# EAGLE design remoteVolume (EAGLE 6.5.0)
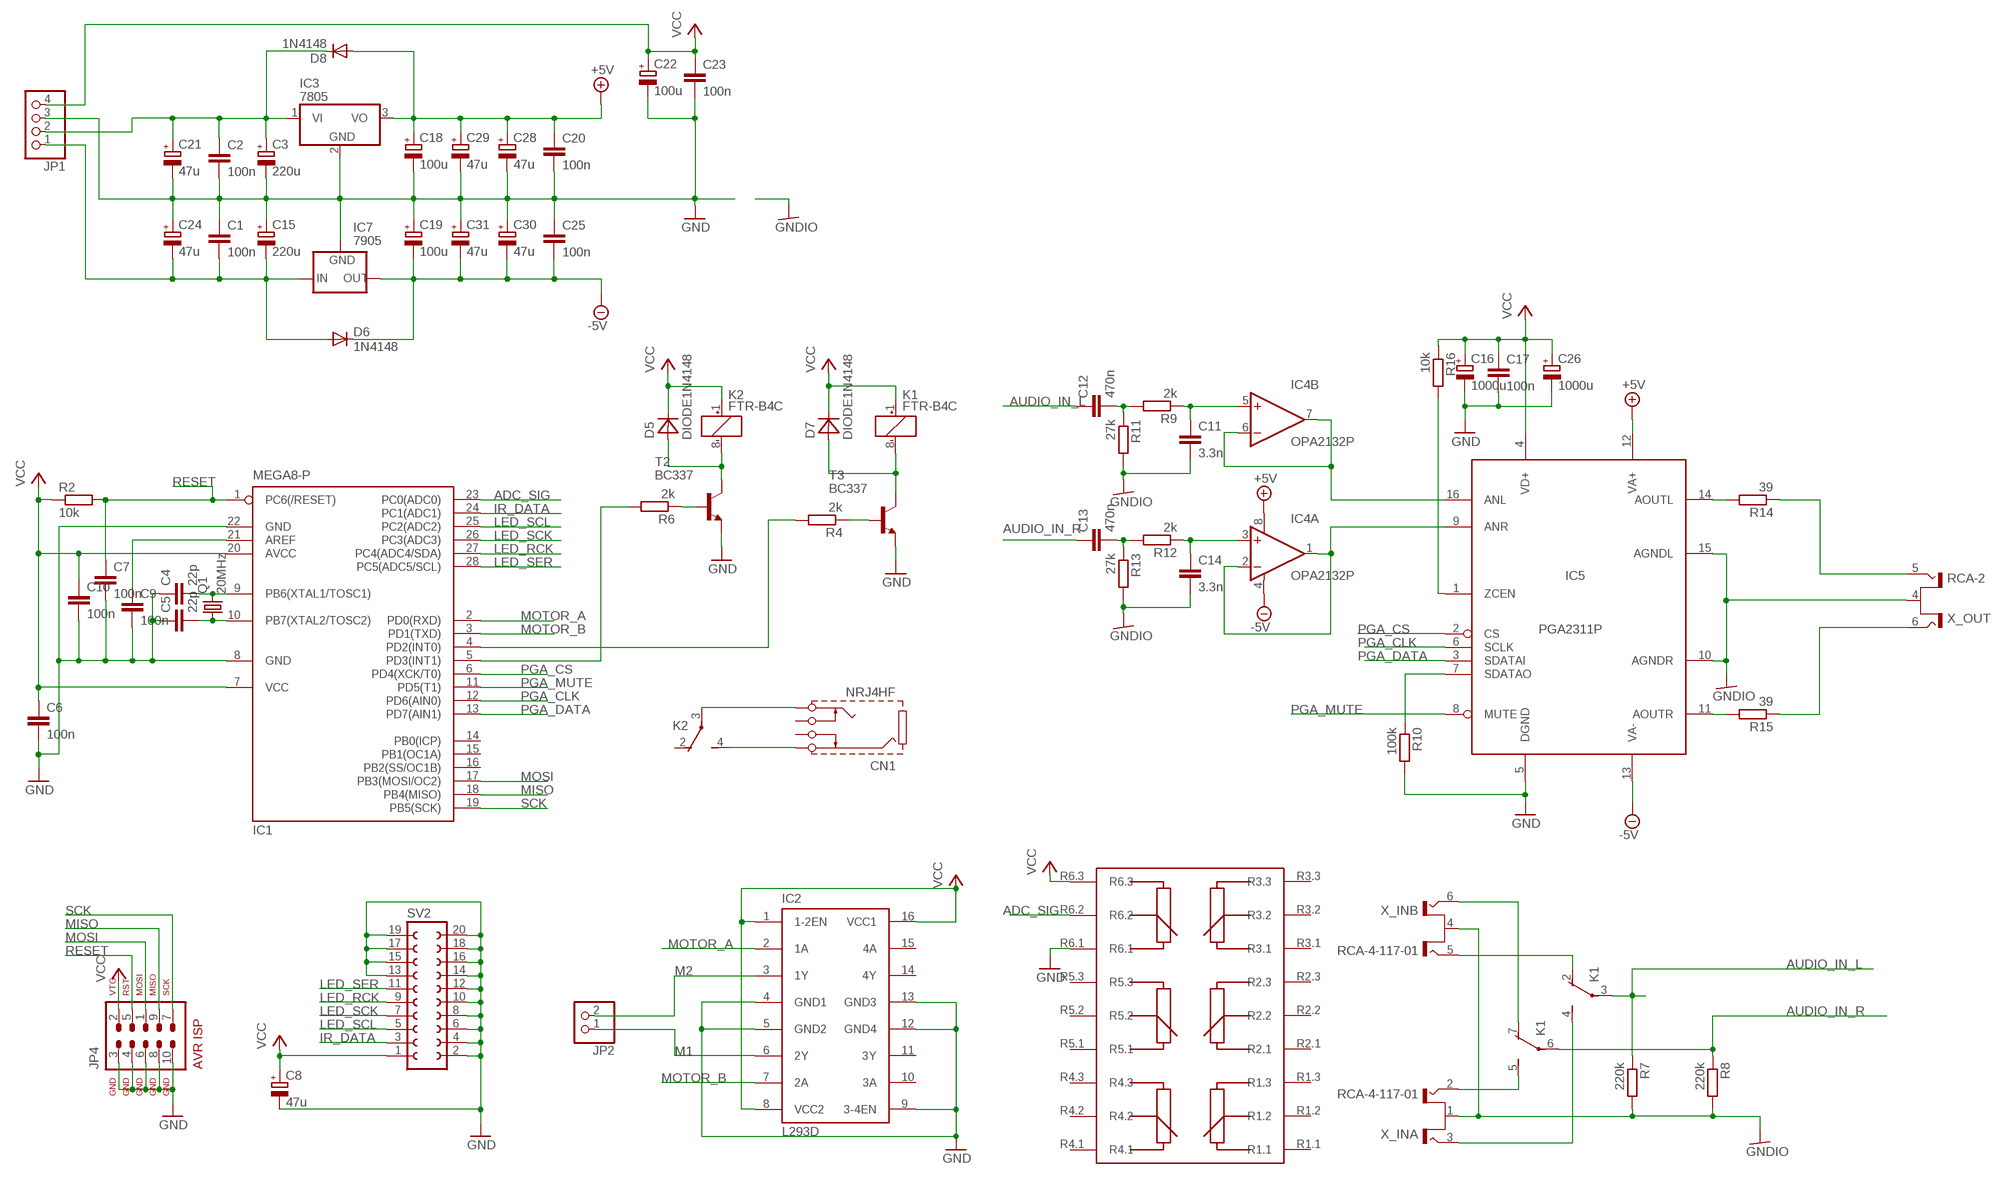
[diagram p0: schematic, sheet 1]

## Parts
C1  100n  C-EU025-025X050  [C025-025X050]
C2  100n  C-EU025-025X050  [C025-025X050]
C3  220u  CPOL-EUE2.5-6  [E2,5-6]
C4  22p  C-EU025-025X050  [C025-025X050]
C5  22p  C-EU025-025X050  [C025-025X050]
C6  100n  C-EU025-025X050  [C025-025X050]
C7  100n  C-EU025-025X050  [C025-025X050]
C8  47u  CPOL-EUE2.5-6  [E2,5-6]
C9  100n  C-EU025-025X050  [C025-025X050]
C10  100n  C-EU025-025X050  [C025-025X050]
C11  3.3n  C-EU050-055X075  [C050-055X075]
C12  470n  C5/3.5  [C5B3.5]
C13  470n  C5/3.5  [C5B3.5]
C14  3.3n  C-EU050-055X075  [C050-055X075]
C15  220u  CPOL-EUE2.5-6  [E2,5-6]
C16  1000u  CPOL-EUE3.5-8  [E3,5-8]
C17  100n  C-EU025-025X050  [C025-025X050]
C18  100u  CPOL-EUE2.5-5  [E2,5-5]
C19  100u  CPOL-EUE2.5-5  [E2,5-5]
C20  100n  C-EU025-025X050  [C025-025X050]
C21  47u  CPOL-EUE2.5-5  [E2,5-5]
C22  100u  CPOL-EUE2.5-5  [E2,5-5]
C23  100n  C-EU025-025X050  [C025-025X050]
C24  47u  CPOL-EUE2.5-5  [E2,5-5]
C25  100n  C-EU025-025X050  [C025-025X050]
C26  1000u  CPOL-EUE3.5-8  [E3,5-8]
C28  47u  CPOL-EUE2.5-5  [E2,5-5]
C29  47u  CPOL-EUE2.5-5  [E2,5-5]
C30  47u  CPOL-EUE2.5-5  [E2,5-5]
C31  47u  CPOL-EUE2.5-5  [E2,5-5]
CN1  NRJ4HF  [NRJ4HF]
D5  DIODE1N4148  [DO-35]
D6  1N4148  1N4148DO35-7  [DO35-7]
D7  DIODE1N4148  [DO-35]
D8  1N4148  1N4148DO35-7  [DO35-7]
IC1  MEGA8-P  [DIL28-3]
IC2  L293D  [DIL16]
IC3  7805  7805TV  [TO220V]
IC4  OPA2132P  [DIL08]
IC5  PGA2311P  [DIL16]
IC7  7905  79XXS  [79XXS]
JP1  PINHD-1X4/90  [1X04/90]
JP2  PINHD-1X2  [1X02]
JP4  AVR-ISP-10  [AVR-ISP-10]
K1  FTR-B4C  [FTR-B4C]
K2  FTR-B4C  [FTR-B4C]
Q1  20MHz  CRYSTALHC49S  [HC49/S]
R2  10k  R-EU_0207/7  [0207/7]
R4  2k  R-EU_0207/7  [0207/7]
R6  2k  R-EU_0207/7  [0207/7]
R7  220k  R-EU_0207/7  [0207/7]
R8  220k  R-EU_0207/7  [0207/7]
R9  2k  R-EU_0207/7  [0207/7]
R10  100k  R-EU_0207/7  [0207/7]
R11  27k  R-EU_0207/7  [0207/7]
R12  2k  R-EU_0207/7  [0207/7]
R13  27k  R-EU_0207/7  [0207/7]
R14  39  R-EU_0207/7  [0207/7]
R15  39  R-EU_0207/7  [0207/7]
R16  10k  R-EU_0207/7  [0207/7]
SV2  FE10-2W  [FE10-2W]
T2  BC337  [TO92]
T3  BC337  [TO92]
U$1  RK16816MG  [RK16816MG]
X_IN  RCA-4-117-01  [RCA-4-117-01]
X_OUT  RCA-2  [RCA-2]

## Nets
+5V: C18.+ C20.1 C28.+ C29.+ D8.A IC3.3(VO) IC4.8(A:V+) IC5.12(VA+)
-5V: C19.- C25.2 C30.- C31.- D6.C IC4.4(A:V-) IC5.13(VA-) IC7.OUT
ADC_SIG: IC1.23(PC0(ADC0)) U$1.R6.2
AUDIO_IN_L: C12.1 K1.3(-1:P) R7.1
AUDIO_IN_R: C13.1 K1.6(-2:P) R8.1
GND: C1.1 C2.2 C3.- C4.1 C5.1 C6.2 C7.2 C8.- C9.2 C10.2 C15.+ C16.- C17.2 C18.- C19.+ C20.2 C21.- C22.- C23.2 C24.+ C25.1 C26.- C28.- C29.- C30.+ C31.+ IC1.8(GND) IC1.22(GND) IC2.4(GND1) IC2.5(GND2) IC2.9(3-4EN) IC2.12(GND4) IC2.13(GND3) IC3.2(GND) IC5.5(DGND) IC7.GND JP1.3 JP4.3 JP4.4 JP4.6 JP4.8 JP4.10 R10.2 SV2.2 SV2.4 SV2.6 SV2.8 SV2.10 SV2.12 SV2.13 SV2.14 SV2.15 SV2.16 SV2.17 SV2.18 SV2.19 SV2.20 T2.1(E) T3.1(E) U$1.R6.1
GNDIO: C11.2 C14.2 IC5.10(AGNDR) IC5.15(AGNDL) R7.2 R8.2 R11.2 R13.2 X_IN.1(A:S) X_IN.4(B:S) X_OUT.4(S)
IR_DATA: IC1.24(PC1(ADC1)) SV2.3
LED_RCK: IC1.27(PC4(ADC4/SDA)) SV2.9
LED_SCK: IC1.26(PC3(ADC3)) SV2.7
LED_SCL: IC1.25(PC2(ADC2)) SV2.5
LED_SER: IC1.28(PC5(ADC5/SCL)) SV2.11
M1: IC2.6(2Y) JP2.1
M2: IC2.3(1Y) JP2.2
MISO: IC1.18(PB4(MISO)) JP4.9
MOSI: IC1.17(PB3(MOSI/OC2)) JP4.1
MOTOR_A: IC1.2(PD0(RXD)) IC2.2(1A)
MOTOR_B: IC1.3(PD1(TXD)) IC2.7(2A)
N$1: CN1.SLEEVE K2.4(-1:S)
N$2: IC4.1(A:OUT) IC4.2(A:-IN) IC5.9(ANR)
N$3: C2.1 C3.+ C21.+ D8.C IC3.1(VI) JP1.2
N$4: C1.2 C15.- C24.- D6.A IC7.IN JP1.1
N$5: K1.5(-2:S) X_IN.2(A:T1)
N$6: D7.+ K1.8(K:-) T3.3(C)
N$7: C4.2 IC1.9(PB6(XTAL1/TOSC1)) Q1.2
N$8: C5.2 IC1.10(PB7(XTAL2/TOSC2)) Q1.1
N$9: R4.1 T3.2(B)
N$10: IC1.4(PD2(INT0)) R4.2
N$11: K1.7(-2:O) X_IN.6(B:T2)
N$12: IC1.5(PD3(INT1)) R6.2
N$14: K1.2(-1:O) X_IN.5(B:T1)
N$15: R6.1 T2.2(B)
N$17: K1.4(-1:S) X_IN.3(A:T2)
N$18: D5.+ K2.8(K:-) T2.3(C)
N$20: CN1.TIP K2.3(-1:P)
N$22: C9.1 IC1.21(AREF)
N$23: IC4.6(B:-IN) IC4.7(B:OUT) IC5.16(ANL)
N$25: C12.2 R9.2 R11.1
N$27: C11.1 IC4.5(B:+IN) R9.1
N$29: C14.1 IC4.3(A:+IN) R12.1
N$31: R14.1 X_OUT.5(T1)
N$32: R15.1 X_OUT.6(T2)
N$33: C13.2 R12.2 R13.1
N$35: IC5.7(SDATAO) R10.1
N$36: IC5.14(AOUTL) R14.2
N$37: IC5.11(AOUTR) R15.2
N$38: IC5.1(ZCEN) R16.2
PGA_CLK: IC1.12(PD6(AIN0)) IC5.6(SCLK)
PGA_CS: IC1.6(PD4(XCK/T0)) IC5.2(CS)
PGA_DATA: IC1.13(PD7(AIN1)) IC5.3(SDATAI)
PGA_MUTE: IC1.11(PD5(T1)) IC5.8(MUTE)
RESET: C7.1 IC1.1(PC6(/RESET)) JP4.5 R2.2
SCK: IC1.19(PB5(SCK)) JP4.7
VCC: C6.1 C8.+ C10.1 C16.+ C17.1 C22.+ C23.1 C26.+ D5.- D7.- IC1.7(VCC) IC1.20(AVCC) IC2.1(1-2EN) IC2.8(VCC2) IC2.16(VCC1) IC5.4(VD+) JP1.4 JP4.2 K1.1(K:+) K2.1(K:+) R2.1 R16.1 SV2.1 U$1.R6.3
Unconnected: CN1.SLEEVE-S CN1.TIP-S IC1.14(PB0(ICP)) IC1.15(PB1(OC1A)) IC1.16(PB2(SS/OC1B)) IC2.10(3A) IC2.11(3Y) IC2.14(4Y) IC2.15(4A) K2.2(-1:O) K2.5(-2:S) K2.6(-2:P) K2.7(-2:O) U$1.R1.1 U$1.R1.2 U$1.R1.3 U$1.R2.1 U$1.R2.2 U$1.R2.3 U$1.R3.1 U$1.R3.2 U$1.R3.3 U$1.R4.1 U$1.R4.2 U$1.R4.3 U$1.R5.1 U$1.R5.2 U$1.R5.3

## Library data of the parts
C1 C2 C4-C7 C9-C11 C14 C17 C20 C23 C25 = rcl:C-EU: CAPACITOR, European symbol
C3 C8 C15 C16 C18 C19 C21 C22 C24 C26 C28-C31 = rcl:CPOL-EU: POLARIZED CAPACITOR, European symbol
C12 C13 = capacitor-wima:C: CAPACITOR naming: grid - package width
CN1 = audio:NRJ4HF: Neutrik 1/4" Mono Phone Connector
D5 D7 = Diodes:DIODE: Diode; SPICE: D{NAME} {+.NET} {-.NET} 1N4148; SPICEMOD: .model 1N4148 D (IS=0.1PA, RS=16 CJO=2PF TT=12N BV=100 IBV=1nA)
D6 D8 = diode:1N4148: DIODE high speed (Philips)
IC1 = atmel:MEGA8-P: MICROCONTROLLER 8 Kbytes FLASH, 1 kbytes SRAM, 512 bytes EEPROM, USART, 4-channel 10 bit ADC, 2-channel 8 bit ADC Pin compatible with Atmega48, ATMega88, ATMega168 Source: avr.lbr; OC_FARNELL: unknown; OC_NEWARK: unknown
IC2 = st-microelectronics:L293D: PUSH-PULL 4 CHANNEL DRIVER; MPN: L293D; OC_FARNELL: 9589619; OC_NEWARK: 56P8249
IC3 = linear:78*: Positive VOLTAGE REGULATOR Source: http://cache.national.com/ds/LM/LM78L05.pdf http://www.fairchildsemi.com/ds/LM/LM7805.pdf
IC4 = burr-brown:OPA2132: High Speed FET-Input Operational Amplifiers< Product Folder:OPA2132; MPN: OPA2132P; OC_FARNELL: 1212432; OC_NEWARK: 47P7461
IC5 = PGA2311:PGA2311
IC7 = v-reg:79XXS: VOLTAGE REGULATOR
JP1 = pinhead:PINHD-1X4: PIN HEADER
JP2 = pinhead:PINHD-1X2: PIN HEADER
JP4 = dreimalbe:AVR-ISP-10: AVR ISP-10 Serial Programming Header
K1 K2 = relay:FTR-B4: ULTRA MINIATURE RELAY 2 POLES - 2 A (Slim Profile Signal Relay) FUJITSU FTR-B4 SERIES Source: FTR-B4.pdf
Q1 = crystal:CRYSTAL: CRYSTAL
R2 R4 R6-R16 = rcl:R-EU_: RESISTOR, European symbol
SV2 = dreimalbe:FE10-2W: FEMALE HEADER; OC_FARNELL: unknown; OC_NEWARK: unknown
T2 T3 = transistor:BC337: NPN TRANSISTOR
U$1 = dreimalbe:RK16816MG
X_IN = con-conrad:RCA-4-117-01: Cinch-Anschlussplatte 72385 Gold, Rot, Weiß BKL Electronic Conrad Bestellnummer : 736910 - 62 Source: Data sheet <http://www.produktinfo.conrad.com/datenblaetter/725000-749999/736910-da-01-en-Cinch_Anschlussplatte_4polig.pdf>
X_OUT = dreimalbe:RCA-2

## Board
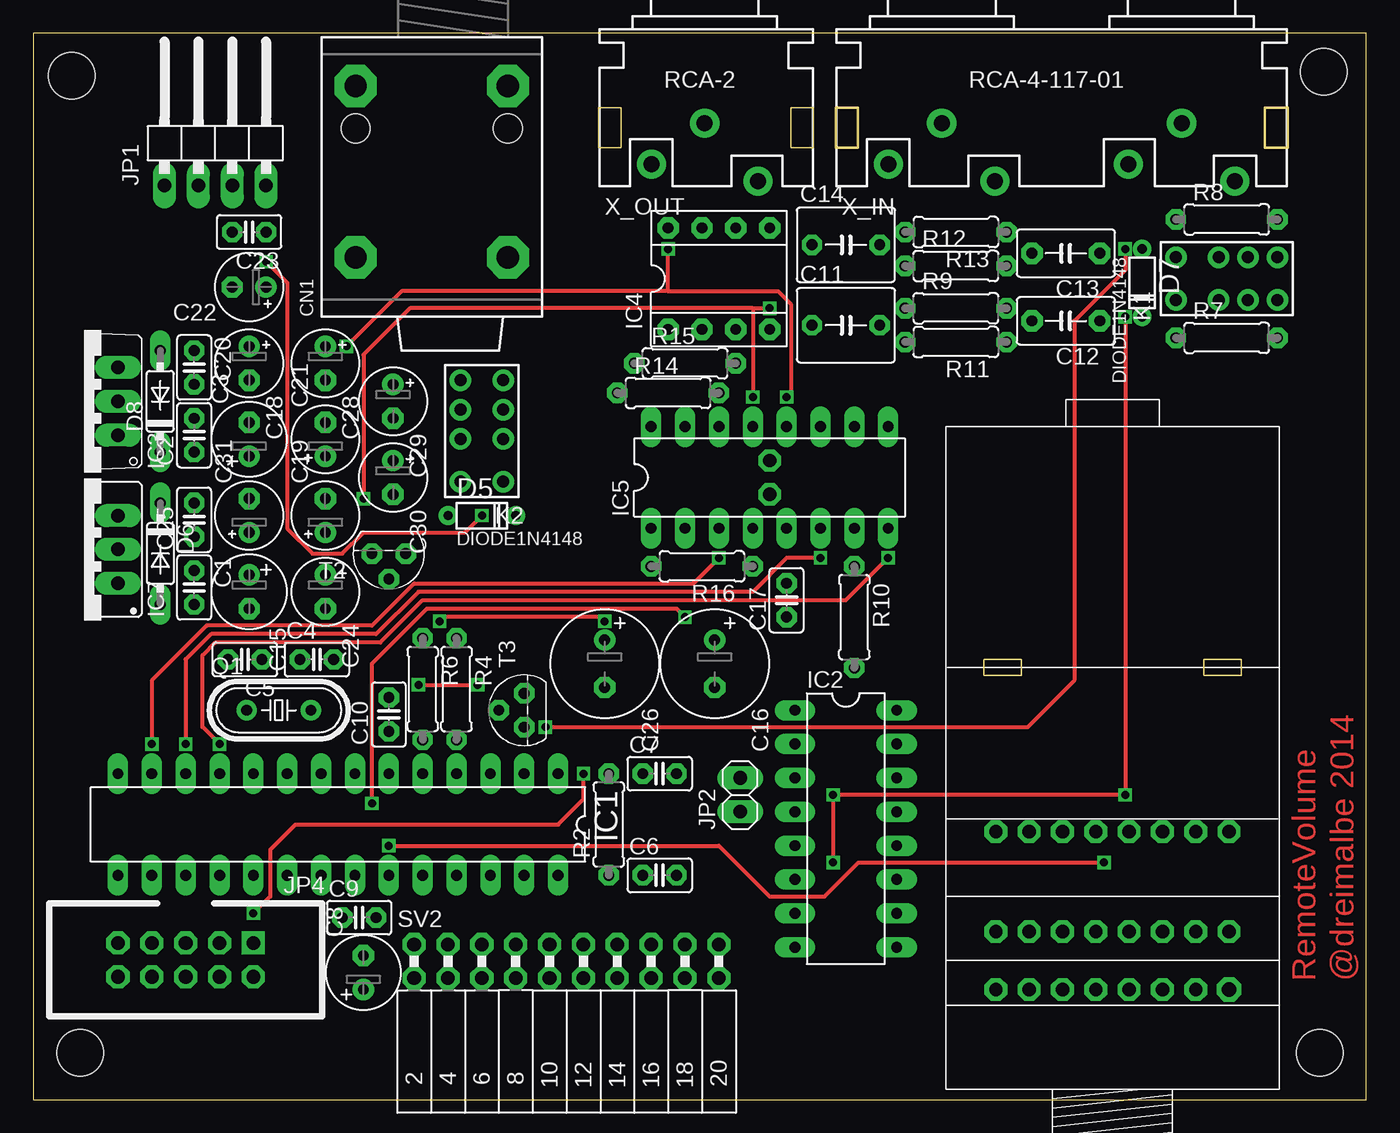
[diagram p1: board, top side]
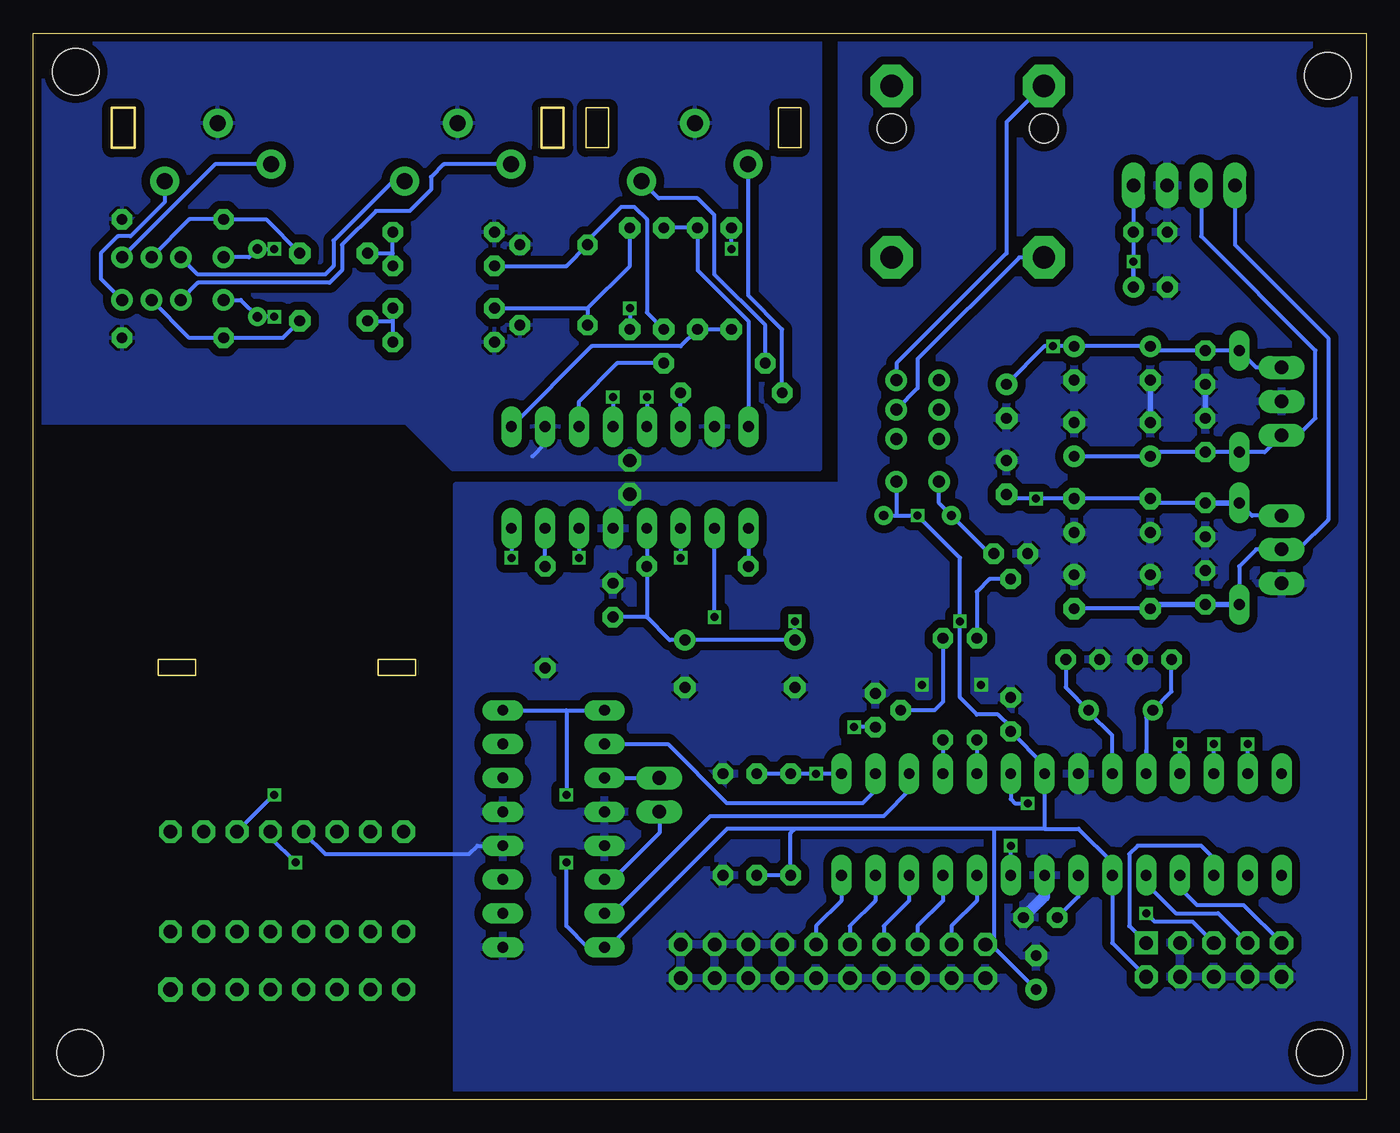
[diagram p2: board, bottom side, seen from below]

Size 100 x 80 mm. Coordinates in mm from the lower left corner, seen from the top.
Outline: 0,0 100,0 100,80 0,80 0,0
Copper layers (1*16): Top 0.035mm / dielectric 1.5mm / Bottom 0.035mm
Design rules "pcb-devboards_35þmCU_200þm_Strukturen_Abstaende *": minimum track width 0.2mm, minimum drill 0.3mm, track to track 0.2mm, track to pad 0.2mm, pad to pad 0.2mm, via to via 0.2mm, smd to smd 0.2mm, copper to edge 0.4mm, drill to drill 0.4mm, minimum pad ring 14mil, minimum via ring 0.2mm, stop-mask expansion 4mil, vias tented up to drill 0mil, thermal gap 0.2mm
Holes 3.5 mm at 3.5,3.5 96.82,77.14 96.5,3.5 2.87,76.82
bRestrict: area 47.3,52.4 to 50.2,53.3; area 58.2,52.2 to 60.9,54.8; area 61.6,60.3 to 64.5,61.3

### Footprints (pad centres in the part's own frame; a part is rotated, then mirrored left to right if it is on the bottom)
C025-025X050 = drill 0.813 octagon: 1 -1.27,0; 2 1.27,0
E2,5-6 = drill 0.813 pad 1.6: + -1.27,0 | drill 0.813 pad 1.6 octagon: - 1.27,0
C050-055X075 = drill 0.813 octagon: 1 -2.54,0; 2 2.54,0
C5B3.5 = drill 0.813 pad 1.6 octagon: 1 -2.54,0; 2 2.54,0
E3,5-8 = drill 0.813 pad 1.6: + -1.778,0 | drill 0.813 pad 1.6 octagon: - 1.778,0
E2,5-5 = drill 0.813 pad 1.6: + -1.27,0 | drill 0.813 pad 1.6 octagon: - 1.27,0
NRJ4HF = drill 1.676 pad 3.175 octagon: SLEEVE 8.414,7.25; SLEEVE-S 8.414,-4.18; TIP -4.445,7.25; TIP-S -4.445,-4.18 | hole 2.184: 5.239,7.25; 5.239,-4.18
DO-35 = drill 0.7: + -2.54,0; - 2.54,0
DO35-7 = drill 0.813 long: A 3.81,0; C -3.81,0
DIL28-3 = drill 0.813 long: 1 -16.51,-3.81; 2 -13.97,-3.81; 3 -11.43,-3.81; 4 -8.89,-3.81; 5 -6.35,-3.81; 6 -3.81,-3.81; 7 -1.27,-3.81; 8 1.27,-3.81; 9 3.81,-3.81; 10 6.35,-3.81; 11 8.89,-3.81; 12 11.43,-3.81; 13 13.97,-3.81; 14 16.51,-3.81; 15 16.51,3.81; 16 13.97,3.81; 17 11.43,3.81; 18 8.89,3.81; 19 6.35,3.81; 20 3.81,3.81; 21 1.27,3.81; 22 -1.27,3.81; 23 -3.81,3.81; 24 -6.35,3.81; 25 -8.89,3.81; 26 -11.43,3.81; 27 -13.97,3.81; 28 -16.51,3.81
DIL16 = drill 0.813 long: 1 -8.89,-3.81; 2 -6.35,-3.81; 3 -3.81,-3.81; 4 -1.27,-3.81; 5 1.27,-3.81; 6 3.81,-3.81; 7 6.35,-3.81; 8 8.89,-3.81; 9 8.89,3.81; 10 6.35,3.81; 11 3.81,3.81; 12 1.27,3.81; 13 -1.27,3.81; 14 -3.81,3.81; 15 -6.35,3.81; 16 -8.89,3.81
TO220V = drill 1.016 long: 1 -2.54,-2.54; 2 0,-2.54; 3 2.54,-2.54
DIL08 = drill 0.813 pad 1.6 octagon: 1 -3.81,-3.81; 2 -1.27,-3.81; 3 1.27,-3.81; 4 3.81,-3.81; 5 3.81,3.81; 6 1.27,3.81; 7 -1.27,3.81; 8 -3.81,3.81
79XXS = drill 1.016 long: GND -2.54,-2.54; IN 0,-2.54; OUT 2.54,-2.54
1X04/90 = drill 1.016 long: 1 -3.81,-3.81; 2 -1.27,-3.81; 3 1.27,-3.81; 4 3.81,-3.81
1X02 = drill 1.016 long: 1 -1.27,0; 2 1.27,0
AVR-ISP-10 = drill 1.016 square: 1 -5.08,-1.27 | drill 1.016 octagon: 2 -5.08,1.27; 3 -2.54,-1.27; 4 -2.54,1.27; 5 0,-1.27; 6 0,1.27; 7 2.54,-1.27; 8 2.54,1.27; 9 5.08,-1.27; 10 5.08,1.27
FTR-B4C = drill 0.9 pad 1.422: 1 -3.8,-1.6; 2 -0.6,-1.6; 3 1.6,-1.6; 4 3.8,-1.6; 5 3.8,1.6; 6 1.6,1.6; 7 -0.6,1.6; 8 -3.8,1.6
HC49/S = drill 0.813: 1 -2.413,0; 2 2.413,0
0207/7 = drill 0.813 octagon: 1 -3.81,0; 2 3.81,0
FE10-2W = drill 1.016 octagon: 1 -11.43,1.27; 2 -11.43,-1.27; 3 -8.89,1.27; 4 -8.89,-1.27; 5 -6.35,1.27; 6 -6.35,-1.27; 7 -3.81,1.27; 8 -3.81,-1.27; 9 -1.27,1.27; 10 -1.27,-1.27; 11 1.27,1.27; 12 1.27,-1.27; 13 3.81,1.27; 14 3.81,-1.27; 15 6.35,1.27; 16 6.35,-1.27; 17 8.89,1.27; 18 8.89,-1.27; 19 11.43,1.27; 20 11.43,-1.27
TO92 = drill 0.813 octagon: 1 1.27,0; 2 0,1.905; 3 -1.27,0
RK16816MG = drill 1 pad 1.676 octagon: DUMMY_R1 -8.75,0; DUMMY_R3 -8.75,4.35; DUMMY_R4 8.75,4.35; DUMMY_R5 -8.75,11.85; DUMMY_R6 8.75,11.85; R1.1 -3.75,0; R1.2 -6.25,0; R1.3 6.25,0; R2.1 -1.25,0; R2.2 1.25,0; R2.3 3.75,0; R3.1 -3.75,4.35; R3.2 -6.25,4.35; R3.3 6.25,4.35; R4.1 -1.25,4.35; R4.2 1.25,4.35; R4.3 3.75,4.35; R5.1 -3.75,11.85; R5.2 -6.25,11.85; R5.3 6.25,11.85; R6.1 -1.25,11.85; R6.2 1.25,11.85; R6.3 3.75,11.85 | drill 1.1 pad 1.676 octagon: DUMMY_R2 8.75,0
RCA-4-117-01 = drill 1.2 pad 2.184: 1 9,3.1; 2 5,0; 3 13,-1.25; 4 -9,3.1; 5 -13,0; 6 -5,-1.25
RCA-2 = drill 1.2 pad 2.184: 4 -0.11,3.1; 5 -4.11,0; 6 3.89,-1.25

### Placement (x,y rotation side)
C1  12.06,38.42 270 top
C2  12.06,49.85 90 top
C3  16.19,49.53 90 top
C4  21.27,33.02 0 top
C5  15.88,33.02 180 top
C6  46.99,16.83 0 top
C7  46.99,24.45 0 top
C8  24.77,9.53 90 top
C9  24.45,13.65 0 top
C10  26.67,28.89 90 top
C11  60.96,58.1 0 top
C12  77.47,58.42 180 top
C13  77.47,63.5 180 top
C14  60.96,64.14 0 top
C15  16.19,38.1 270 top
C16  51.12,32.7 270 top
C17  56.52,37.47 90 top
C18  16.19,55.24 270 top
C19  21.91,43.81 90 top
C20  12.06,54.93 270 top
C21  21.91,49.53 90 top
C22  16.19,60.96 180 top
C23  16.19,65.09 180 top
C24  21.91,38.1 270 top
C25  12.06,43.5 90 top
C26  42.86,32.7 270 top
C28  21.91,55.24 270 top
C29  26.99,52.39 270 top
C30  26.99,46.67 270 top
C31  16.19,43.81 90 top
CN1  31.43,67.63 90 top
D5  33.66,43.81 0 top
D6  9.53,40.96 270 top
D7  83.19,61.28 270 top
D8  9.53,52.39 90 top
IC1  22.86,20.64 180 top
IC2  60.96,20.32 270 top
IC3  3.81,52.39 90 top
IC4  51.44,61.59 0 top
IC5  55.24,46.67 0 top
IC7  3.81,41.27 90 top
JP1  13.65,72.39 0 top
JP2  53.02,22.86 90 top
JP4  11.43,10.48 180 top
K1  89.53,61.59 0 top
K2  33.66,50.16 90 top
Q1  18.41,29.21 0 top
R2  43.18,20.64 90 top
R4  31.75,30.8 270 top
R6  29.21,30.8 270 top
R7  89.53,57.15 0 top
R8  89.53,66.04 0 top
R9  69.22,59.37 0 top
R10  61.59,36.2 270 top
R11  69.22,56.83 180 top
R12  69.22,62.55 0 top
R13  69.22,65.09 180 top
R14  47.62,53.02 0 top
R15  48.9,55.24 0 top
R16  50.16,40.01 180 top
SV2  40,10.37 0 top
T2  26.67,40.96 180 top
T3  36.83,29.21 90 top
U$1  80.96,8.26 0 top
X_IN  77.15,70.17 0 top
X_OUT  50.48,70.17 0 top

### Tracks (layer width: path | path; a pad name or v marks a point on that pad's centre or on a via)
+5V  (via drill 0.6)
  Top 0.305: 47.62,60.64 v47.62,63.82 | 47.62,60.64 55.88,60.64 56.83,59.69 56.83,53.02 v56.52,52.7 | 47.62,60.64 27.62,60.64 v23.5,56.52
  Bottom 0.305: v47.62,63.82 IC4.8 | v56.52,52.7 IC5.12 | IC3.3 8.26,54.93 D8.A C20.1 15.88,56.2 C18.+ C28.+ v23.5,56.52 24.13,56.52 C29.+
-5V  (via drill 0.6)
  Top 0.305: 53.98,59.37 v53.98,52.7 | 53.98,59.37 v55.24,59.37 | 53.98,59.37 28.26,59.37 24.77,55.88 v24.77,45.09
  Bottom 0.305: v53.98,52.7 IC5.13 | v55.24,59.37 IC4.4 | C25.2 15.88,44.77 C31.- C19.- v24.77,45.09 26.67,45.09 C30.- | IC7.OUT 8.57,43.81 D6.C
  Bottom 0.406: D6.C C25.2
ADC_SIG  (via drill 0.6)
  Top 0.305: v26.67,19.05 51.44,19.05 55.24,15.24 59.37,15.24 61.91,17.78 v80.33,17.78
  Bottom 0.305: IC1.23 v26.67,19.05 | U$1.R6.2 82.21,19.66 v80.33,17.78
AUDIO_IN_L
  Bottom 0.305: K1.3 88.29,57.15 R7.1 81.28,57.15 C12.1
AUDIO_IN_R
  Bottom 0.305: K1.6 88.29,66.04 R8.1 82.55,66.04 C13.1
GND  (via drill 0.6, 1 pad 1.68)
  Top 0.305: v28.89,31.11 v33.34,31.11
  Bottom 0.305: U$1.R6.1 79.71,20.02 78.11,18.41 67.31,18.41 66.67,19.05 IC2.12
  Bottom 0.406: C18.- C3.- | C20.2 C2.2
  Bottom 0.813: IC1.22 24.13,15.24 C9.2
  other vias: 55.24,45.4
  pour Bottom (isolate 0.61): 0,80.01 39.37,80.01 39.37,46.04 68.26,46.04 68.26,0.32 0,0.32
GNDIO  (via drill 1 pad 1.68)
  Bottom 0.305: 62.55,48.26 61.59,49.21 IC5.10 | 48.9,49.53 IC5.15
  other vias: 55.24,47.94
  pour Bottom (isolate 0.61): 40.96,80.01 100.01,80.01 100.01,50.8 72.07,50.8 68.58,47.31 40.96,47.31
IR_DATA
  Bottom 0.305: IC1.24 29.21,14.92 31.11,13.02 SV2.3
LED_RCK
  Bottom 0.305: IC1.27 36.83,14.92 38.73,13.02 SV2.9
LED_SCK
  Bottom 0.305: IC1.26 34.29,14.92 36.2,13.02 SV2.7
LED_SCL
  Bottom 0.305: IC1.25 31.75,14.92 33.66,13.02 SV2.5
LED_SER
  Bottom 0.305: IC1.28 39.37,14.92 41.27,13.02 SV2.11
M1
  Bottom 0.305: JP2.1 53.02,20 56.52,16.51 IC2.6
M2
  Bottom 0.305: IC2.3 JP2.2
MISO
  Bottom 0.305: IC1.18 13.97,15.88 12.7,14.61 9.21,14.61 JP4.9
MOSI
  Bottom 0.305: IC1.17 11.43,18.1 12.38,19.05 17.14,19.05 17.78,18.41 17.78,13.02 JP4.1
MOTOR_A
  Bottom 0.305: IC1.2 36.83,23.18 37.78,22.23 47.94,22.23 52.39,26.67 IC2.2
MOTOR_B
  Bottom 0.305: IC1.3 34.29,23.18 36.2,21.27 49.21,21.27 56.52,13.97 IC2.7
N$1
  Bottom 0.305: CN1.SLEEVE 24.29,76.04 26.99,73.34 26.99,63.5 35.24,55.24 35.24,53.98 K2.4
N$2
  Bottom 0.305: IC4.1 IC4.2 51.44,56.52 58.1,56.52 IC5.9
N$3
  Bottom 0.305: JP1.2 12.38,64.77 3.81,56.2 3.81,51.12 5.08,49.85 IC3.1 7.62,48.58 D8.C C2.1 15.88,48.58 C3.+ C21.+
N$4
  Bottom 0.305: JP1.1 9.84,64.14 2.86,57.15 2.86,43.5 5.08,41.27 IC7.IN 8.26,41.27 9.53,40.01 D6.A | C15.- C24.-
  Bottom 0.406: C15.- 15.88,37.15 C1.2 D6.A
N$5
  Bottom 0.305: X_IN.2 86.36,70.17 K1.5
N$6  (via drill 0.6)
  Top 0.305: v38.42,27.94 74.61,27.94 78.11,31.43 78.11,58.42 81.92,62.23 v81.92,63.82
  Bottom 0.305: T3.3 v38.42,27.94 | K1.8 83.81,63.2 D7.+ v81.92,63.82
N$7
  Bottom 0.305: IC1.9 19.05,27.3 20.83,29.08 Q1.2 22.54,30.92 C4.2
N$8
  Bottom 0.305: 16.51,26.16 IC1.10 16.51,28.7 Q1.1 14.61,30.61 C5.2
N$9
  Bottom 0.305: R4.1 31.75,29.84 32.38,29.21 T3.2
N$10
  Bottom 0.305: R4.2 IC1.4
N$11
  Bottom 0.305: X_IN.6 73,68.92 77.47,64.45 77.47,62.55 78.11,61.91 87.65,61.91 K1.7
N$12
  Bottom 0.305: R6.2 IC1.5
N$14
  Bottom 0.305: X_IN.5 69.22,70.17 70.17,69.22 70.17,68.26 71.75,66.67 74.3,66.67 76.83,64.14 76.83,62.23 77.79,61.28 87.65,61.28 K1.2
N$15
  Bottom 0.305: T2.2 28.26,39.05 29.21,38.1 R6.1
N$17
  Bottom 0.305: X_IN.3 90.15,67.33 92.71,64.77 93.66,64.77 94.93,63.5 94.93,61.59 K1.4
N$18
  Bottom 0.305: K2.8 32.05,44.76 D5.+ 28.26,40.96 T2.3
N$20
  Bottom 0.305: CN1.TIP 26.04,63.18 33.66,55.56 33.66,53.37 K2.3
N$22
  Bottom 0.305: IC1.21 21.59,15.24 C9.1
N$23
  Bottom 0.305: IC4.6 IC4.7 50.16,62.23 46.35,58.42 IC5.16
N$25
  Bottom 0.305: R9.2 73.03,58.42 | 73.03,58.42 R11.1 | C12.2 73.03,58.42
N$27
  Bottom 0.305: R9.1 58.42,59.37 | 58.42,59.37 55.24,62.55 IC4.5 | 58.42,59.37 C11.1
N$29
  Bottom 0.305: IC4.3 53.98,59.05 53.98,66.04 54.93,66.99 55.88,66.99 58.42,64.45 C14.1 60.01,62.55 R12.1
N$31
  Bottom 0.305: R14.1 43.81,57.78 46.35,60.33 46.35,70.15 X_OUT.5
N$32
  Bottom 0.305: R15.1 45.09,58.1 48.9,61.91 48.9,66.36 50.16,67.63 53.08,67.63 X_OUT.6
N$33
  Bottom 0.305: R12.2 73.03,63.5 | 73.03,63.5 R13.1 | C13.2 73.03,63.5
N$35
  Bottom 0.305: R10.1 IC5.7
N$36
  Bottom 0.305: IC5.14 R14.2
N$37
  Bottom 0.305: IC5.11 59.05,52.39 56.2,55.24 R15.2
N$38
  Bottom 0.305: IC5.1 R16.2
PGA_CLK  (via drill 0.6)
  Top 0.305: v11.43,26.67 11.43,33.02 13.34,34.92 25.72,34.92 28.89,38.1 53.98,38.1 56.52,40.64 v59.05,40.64
  Bottom 0.305: IC5.6 v59.05,40.64 | IC1.12 v11.43,26.67
PGA_CS  (via drill 0.6)
  Top 0.305: v25.4,22.23 25.4,32.7 29.53,36.83 48.26,36.83 v48.9,36.2
  Bottom 0.305: v48.9,36.2 IC5.2 | IC1.6 26.67,22.54 26.35,22.23 v25.4,22.23
PGA_DATA  (via drill 0.6)
  Top 0.305: v51.44,40.64 49.53,38.73 28.57,38.73 25.4,35.56 13.02,35.56 8.89,31.43 v8.89,26.67
  Bottom 0.305: IC5.3 v51.44,40.64 | IC1.13 v8.89,26.67
PGA_MUTE  (via drill 0.6)
  Top 0.305: v64.14,40.64 60.96,37.47 29.21,37.47 26.04,34.29 13.65,34.29 12.7,33.34 12.7,27.94 v13.97,26.67
  Bottom 0.305: IC5.8 v64.14,40.64 | IC1.11 v13.97,26.67
RESET  (via drill 0.6)
  Top 0.305: v41.27,24.45 41.27,22.54 39.37,20.64 19.68,20.64 17.78,18.73 17.78,15.24 v16.51,13.97
  Bottom 0.305: C7.1 R2.2 IC1.1 v41.27,24.45 | 11.11,11.43 JP4.5 13.02,13.34 15.88,13.34 v16.51,13.97
SCK
  Bottom 0.305: IC1.19 16.51,16.19 14.29,13.97 11.11,13.97 JP4.7
VCC  (via drill 0.6)
  Top 0.305: v60.01,17.78 v60.01,22.86 v81.92,22.86 v81.92,58.74 | v17.46,62.87 19.05,61.28 19.05,42.86 20.95,40.96 23.18,40.96 24.77,42.55 32.38,42.55 v33.66,43.81 | v42.86,35.88 42.55,36.2 30.8,36.2 v30.48,35.88
  Bottom 0.305: 24.13,20.32 27.94,20.32 | 27.94,20.32 42.86,20.32 | 42.86,20.32 47.94,20.32 56.83,11.43 IC2.8 58.42,11.43 60.01,13.02 v60.01,17.78 | 24.13,20.32 IC1.7 24.13,25.08 C10.1 26.67,27.94 27.62,28.89 29.21,28.89 30.48,30.16 v30.48,35.88 30.48,40.64 v33.66,43.81 35.24,43.81 | JP4.2 19.05,11.75 IC1.20 19.05,17.78 21.59,20.32 24.13,20.32 | 27.94,20.32 27.94,11.75 | 27.94,11.75 27.94,11.43 C8.+ | SV2.1 28.05,11.64 27.94,11.75 | IC5.4 R16.1 53.98,36.2 | JP1.4 C23.1 C22.+ v17.46,62.87 | IC2.16 60.01,29.21 | 60.01,29.21 IC2.1 | C6.1 R2.1 43.18,20 42.86,20.32 | 60.01,29.21 v60.01,22.86 | K1.1 84.44,59.99 D7.- v81.92,58.74 | v81.92,22.86 81.96,22.86 U$1.R6.3 | D5.- 35.24,43.81 | K2.1 35.26,43.83 35.24,43.81 | v42.86,35.88 C26.+ C16.+ 52.26,34.48 53.98,36.2 | 53.98,36.2 C17.1

### Text on the board
Top: RemoteVolume | @dreimalbe 2014